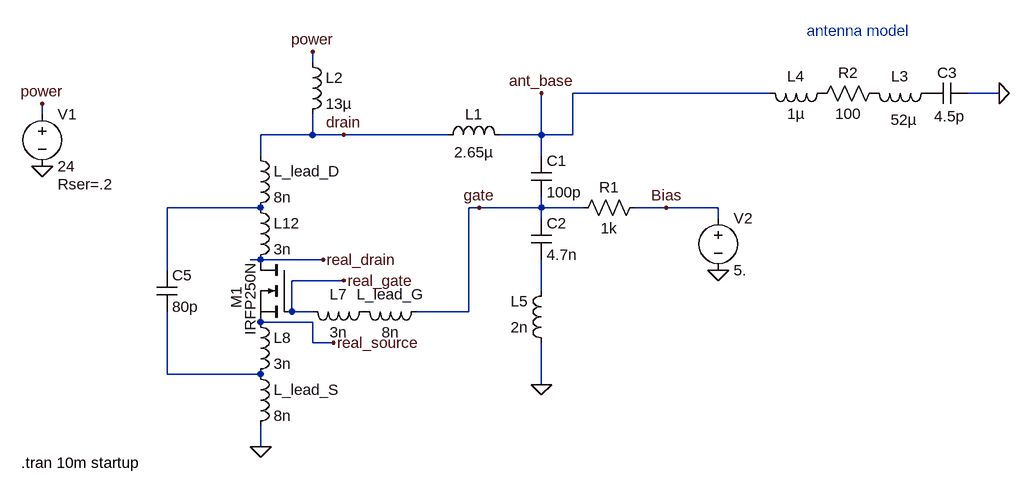
[diagram p0: schematic Mhz10-Plasma_flame_bad_diode.asc]
Mhz10-Plasma_flame_bad_diode.asc, the LTspice schematic file:
Version 4
SHEET 1 1316 696
WIRE 240 -96 240 -112
WIRE 944 -48 640 -48
WIRE 1296 -48 1248 -48
WIRE -176 -16 -176 -32
WIRE 240 16 240 -16
WIRE 240 16 160 16
WIRE 288 16 240 16
WIRE 448 16 288 16
WIRE 592 16 592 -48
WIRE 592 16 528 16
WIRE 640 16 640 -48
WIRE 640 16 592 16
WIRE 160 48 160 16
WIRE 592 48 592 16
WIRE 160 128 16 128
WIRE 496 128 480 128
WIRE 592 128 592 112
WIRE 592 128 496 128
WIRE 656 128 592 128
WIRE 784 128 736 128
WIRE 864 128 784 128
WIRE 592 144 592 128
WIRE 864 144 864 128
WIRE 160 208 144 208
WIRE 256 208 160 208
WIRE 16 224 16 128
WIRE 288 240 208 240
WIRE 592 256 592 208
WIRE 208 288 208 240
WIRE 240 288 208 288
WIRE 480 288 480 128
WIRE 480 288 400 288
WIRE 240 304 160 304
WIRE 240 336 240 304
WIRE 272 336 240 336
WIRE 16 384 16 288
WIRE 160 384 16 384
WIRE 592 400 592 336
WIRE 160 496 160 464
FLAG -176 -32 power
FLAG 240 -112 power
FLAG -176 64 0
FLAG 864 224 0
FLAG 784 128 Bias
FLAG 1296 -48 0
FLAG 592 -48 ant_base
FLAG 496 128 gate
FLAG 288 16 drain
FLAG 592 400 0
FLAG 160 496 0
FLAG 288 240 real_gate
FLAG 256 208 real_drain
FLAG 272 336 real_source
SYMBOL nmos 208 208 M0
WINDOW 0 85 75 VLeft 2
WINDOW 3 64 116 VLeft 2
SYMATTR InstName M1
SYMATTR Value IRFP250N
SYMBOL ind 432 32 R270
WINDOW 0 32 56 VTop 2
WINDOW 3 5 56 VBottom 2
SYMATTR InstName L1
SYMATTR Value 2.65µ
SYMATTR SpiceLine Rser=150m
SYMBOL cap 576 48 R0
SYMATTR InstName C1
SYMATTR Value 100p
SYMATTR SpiceLine Rser=.01
SYMBOL voltage -176 -32 R0
WINDOW 123 0 0 Left 0
WINDOW 39 24 124 Left 2
SYMATTR SpiceLine Rser=.2
SYMATTR InstName V1
SYMATTR Value 24
SYMBOL voltage 864 128 R0
WINDOW 123 0 0 Left 0
WINDOW 39 0 0 Left 0
SYMATTR InstName V2
SYMATTR Value 5.
SYMBOL cap 576 144 R0
SYMATTR InstName C2
SYMATTR Value 4.7n
SYMATTR SpiceLine Rser=.1
SYMBOL ind 224 -112 R0
SYMATTR InstName L2
SYMATTR Value 13µ
SYMATTR SpiceLine Rser=50m
SYMBOL res 752 112 R90
WINDOW 0 0 56 VBottom 2
WINDOW 3 32 56 VTop 2
SYMATTR InstName R1
SYMATTR Value 1k
SYMBOL cap 1248 -64 R90
WINDOW 0 0 32 VBottom 2
WINDOW 3 36 28 VTop 2
SYMATTR InstName C3
SYMATTR Value 4.5p
SYMBOL ind 1200 -64 R90
WINDOW 0 5 56 VBottom 2
WINDOW 3 41 50 VTop 2
SYMATTR InstName L3
SYMATTR Value 52µ
SYMBOL res 1120 -64 R90
WINDOW 0 0 56 VBottom 2
WINDOW 3 32 56 VTop 2
SYMATTR InstName R2
SYMATTR Value 100
SYMBOL ind 1040 -64 R90
WINDOW 0 5 56 VBottom 2
WINDOW 3 32 56 VTop 2
SYMATTR InstName L4
SYMATTR Value 1µ
SYMBOL ind 608 352 R180
WINDOW 0 36 80 Left 2
WINDOW 3 36 40 Left 2
SYMATTR InstName L5
SYMATTR Value 2n
SYMATTR SpiceLine Rser=1m
SYMBOL cap 0 224 R0
SYMATTR InstName C5
SYMATTR Value 80p
SYMBOL ind 144 288 R0
SYMATTR InstName L8
SYMATTR Value 3n
SYMBOL ind 144 32 R0
SYMATTR InstName L_lead_D
SYMATTR Value 8n
SYMBOL ind 336 272 R90
WINDOW 0 5 56 VBottom 2
WINDOW 3 32 56 VTop 2
SYMATTR InstName L7
SYMATTR Value 3n
SYMBOL ind 416 272 R90
WINDOW 0 5 56 VBottom 2
WINDOW 3 32 56 VTop 2
SYMATTR InstName L_lead_G
SYMATTR Value 8n
SYMBOL ind 144 112 R0
SYMATTR InstName L12
SYMATTR Value 3n
SYMBOL ind 144 368 R0
SYMATTR InstName L_lead_S
SYMATTR Value 8n
TEXT 1000 -144 Left 2 ;antenna model
TEXT -208 520 Left 2 !.tran 10m startup

The netlist it stands for:
* Mhz10-Plasma_flame_bad_diode.asc
M1 real_drain real_gate real_source real_source IRFP250N
L1 drain ant_base 2.65µ Rser=150m
C1 ant_base gate 100p Rser=.01
V1 power 0 24 Rser=.2
V2 Bias 0 5.
C2 gate N002 4.7n Rser=.1
L2 power drain 13µ Rser=50m
R1 Bias gate 1k
C3 0 P001 4.5p
L3 P001 P002 52µ
R2 P002 P003 100
L4 P003 ant_base 1µ
L5 0 N002 2n Rser=1m
C5 N001 N003 80p
L8 real_source N003 3n
L_lead_D drain N001 8n
L7 P004 real_gate 3n
L_lead_G gate P004 8n
L12 N001 real_drain 3n
L_lead_S N003 0 8n
.model NMOS NMOS
.model PMOS PMOS
.lib standard.mos
* antenna model
.tran 10m startup
.backanno
.end